# EAGLE schematic Our Project (EAGLE 9.2.0)
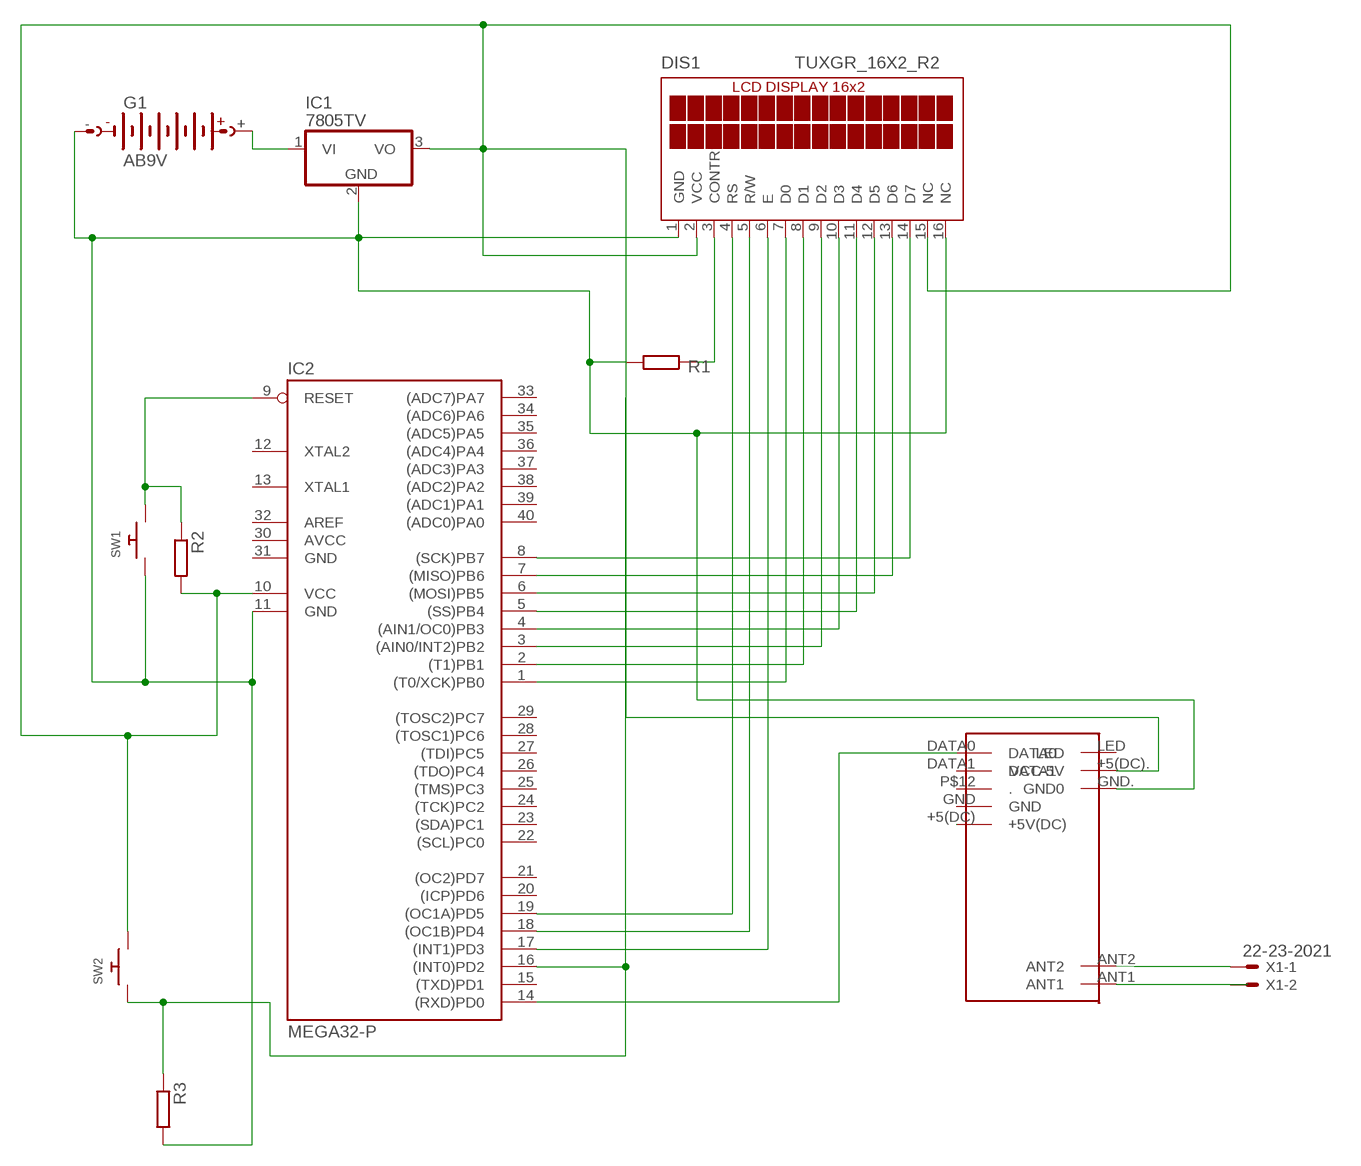
[diagram p0: schematic, sheet 1]

## Parts
DIS1  TUXGR_16X2_R2  [TUXGR_16X2_R2]
G1  AB9V  [AB9V]
IC1  7805TV  [TO220V]
IC2  MEGA32-P  [DIL40]
R1  R0204/7  [0204/7]
R2  R0204/7  [0204/7]
R3  R0204/7  [0204/7]
RFID.MOKH1  KIT.RFID.RDM6300  [KIT.RFID.RDM6300]
SW1  SWITCH_PUSHBUTTONEVQ-PE  [TACT_PANA-EVQ]
SW2  SWITCH_PUSHBUTTONEVQ-PE  [TACT_PANA-EVQ]
X1  22-23-2021  [22-23-2021]

## Nets
N$1: DIS1.14(D7) IC2.8((SCK)PB7)
N$2: DIS1.13(D6) IC2.7((MISO)PB6)
N$3: DIS1.11(D4) IC2.5((SS)PB4)
N$4: DIS1.12(D5) IC2.6((MOSI)PB5)
N$5: DIS1.4(RS) IC2.19((OC1A)PD5)
N$6: DIS1.6(E) IC2.17((INT1)PD3)
N$7: DIS1.3(CONTR) R1.1
N$8: IC2.14((RXD)PD0) RFID.MOKH1.DATA0
N$9: DIS1.2(VCC) DIS1.15(NC) IC1.3(VO) IC2.10(VCC) R2.2 RFID.MOKH1.+5(DC).(VCC-5V) SW2.P$2
N$10: DIS1.1(GND) DIS1.16(NC) G1.- IC1.2(GND) IC2.11(GND) R1.2 R3.2 RFID.MOKH1.GND.(GND0) SW1.P$1
N$11: IC2.9(RESET) R2.1 SW1.P$2
N$12: IC2.16((INT0)PD2) R3.1 SW2.P$1
N$13: G1.+ IC1.1(VI)
N$14: DIS1.10(D3) IC2.4((AIN1/OC0)PB3)
N$15: DIS1.9(D2) IC2.3((AIN0/INT2)PB2)
N$16: DIS1.8(D1) IC2.2((T1)PB1)
N$17: DIS1.7(D0) IC2.1((T0/XCK)PB0)
N$18: RFID.MOKH1.ANT1 X1.2
N$19: RFID.MOKH1.ANT2 X1.1
N$20: DIS1.5(R/W) IC2.18((OC1B)PD4)
N$22: RFID.MOKH1.+5(DC)(+5V(DC))
Unconnected: IC2.12(XTAL2) IC2.13(XTAL1) IC2.15((TXD)PD1) IC2.20((ICP)PD6) IC2.21((OC2)PD7) IC2.22((SCL)PC0) IC2.23((SDA)PC1) IC2.24((TCK)PC2) IC2.25((TMS)PC3) IC2.26((TDO)PC4) IC2.27((TDI)PC5) IC2.28((TOSC1)PC6) IC2.29((TOSC2)PC7) IC2.32(AREF) IC2.33((ADC7)PA7) IC2.34((ADC6)PA6) IC2.35((ADC5)PA5) IC2.36((ADC4)PA4) IC2.37((ADC3)PA3) IC2.38((ADC2)PA2) IC2.39((ADC1)PA1) IC2.40((ADC0)PA0) RFID.MOKH1.DATA1 RFID.MOKH1.GND RFID.MOKH1.LED RFID.MOKH1.P$12(.)

## Power pins joined to a net without a drawn wire
AVCC: IC2.30(AVCC)
GND: IC2.31(GND)

## Library data of the parts
DIS1 = display-lcd:TUXGR_16X2_R2: Tuxgraphics LCD display 16x2 characters reflective, without background light Source: tuxgr_12x2_r2.pdf; OC_FARNELL: unknown; OC_NEWARK: unknown
G1 = battery:AB9V: 9-V BATTERY CLIP
IC1 = linear:78*: Positive VOLTAGE REGULATOR Source: http://cache.national.com/ds/LM/LM78L05.pdf http://www.fairchildsemi.com/ds/LM/LM7805.pdf
IC2 = atmel:MEGA32-P: MICROCONTROLLER 32 Kbytes FLASH 2 Kbytes SRAM 1 Kbytes EEPROM USART 8-channel 10 bit ADC Source: www.atmel.com .. doc2503.pdf; MPN: ATMEGA32-16PU; OC_FARNELL: 1661729; OC_NEWARK: 51P1794
R1-R3 = eagle-ltspice:R: RESISTOR, European symbol; SPICEMODEL: NONE; SPICEPREFIX: R
RFID.MOKH1 = untitled:KIT.RFID.RDM6300
SW1 SW2 = adafruit:SWITCH_PUSHBUTTON: Buttons SOFTTOUCHSMD_SJ - Soft touch temporary push button (Super Junk Akihabara) Compatible with SKPMANE010 [Mouser: 688-SKPMAN] C&K_KSS = Digikey: KSS221GLFS
X1 = con-molex:22-23-2021: .100" (2.54mm) Center Header - 2 Pin; MF: MOLEX; MPN: 22-23-2021; OC_FARNELL: 1462926; OC_NEWARK: 25C3832